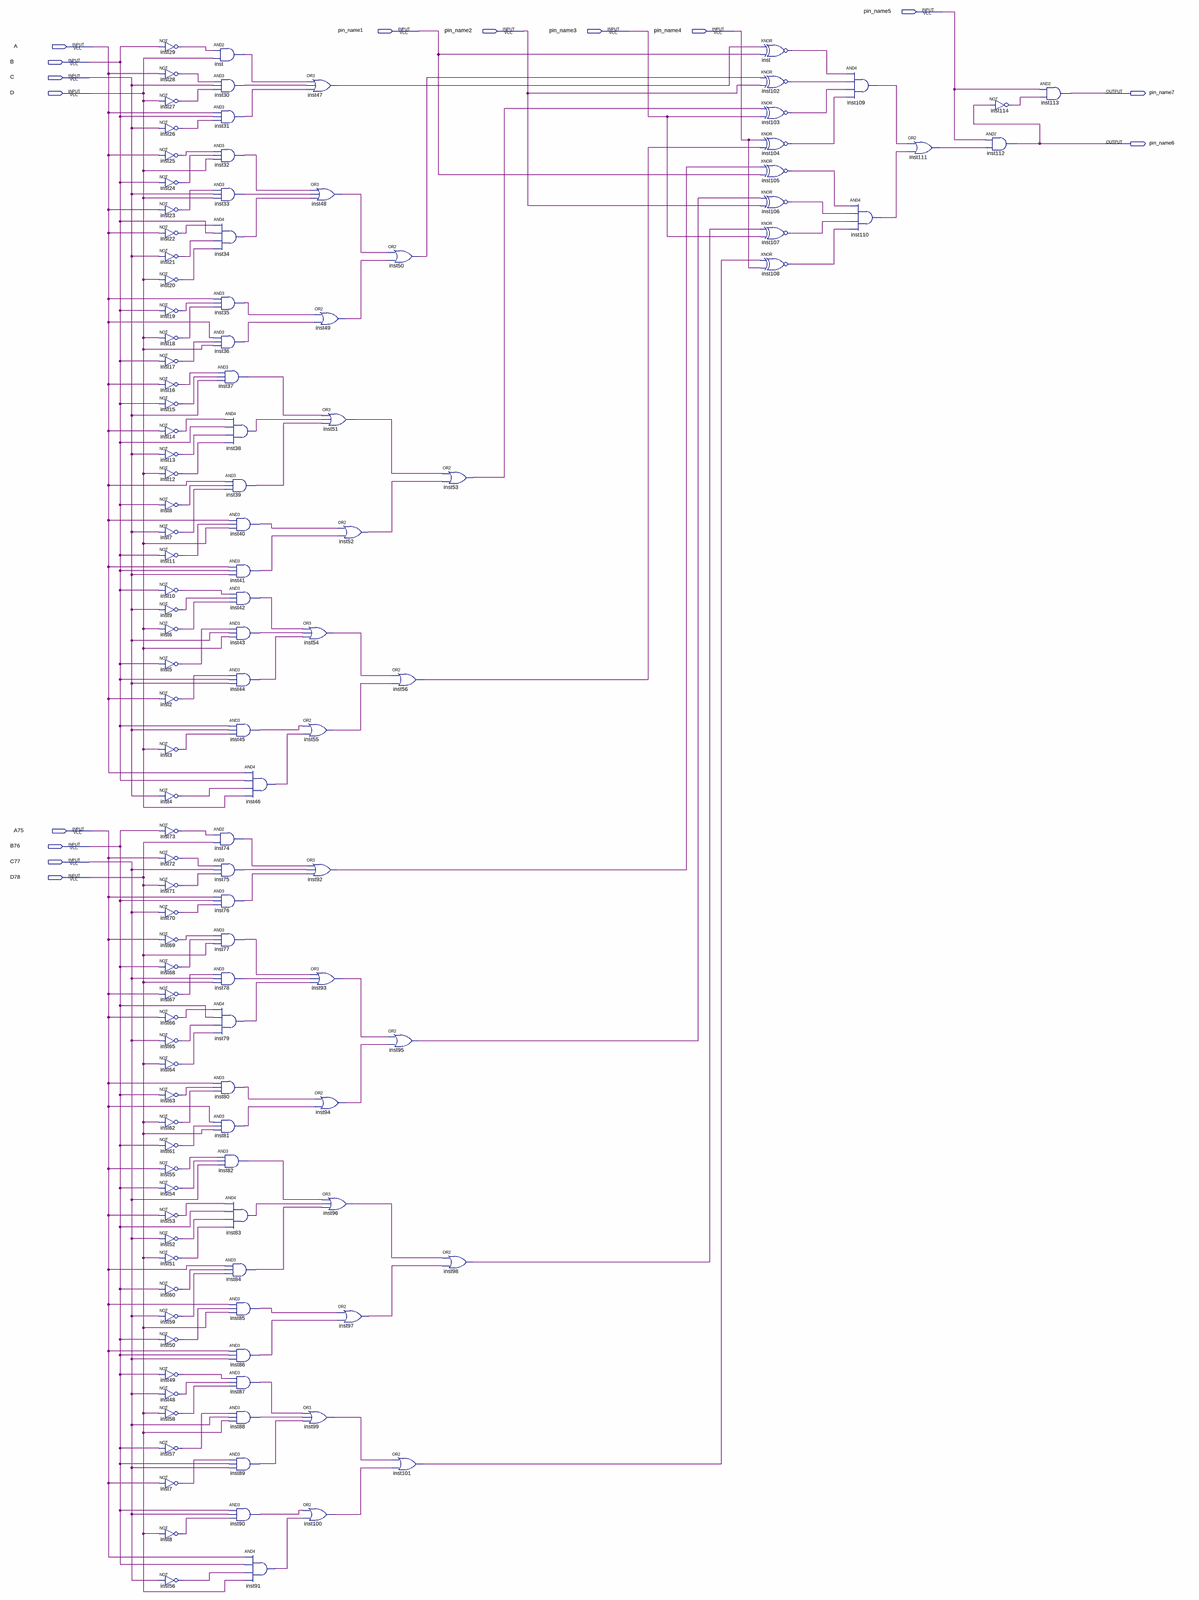
[diagram p0: schematic sheet, whole]
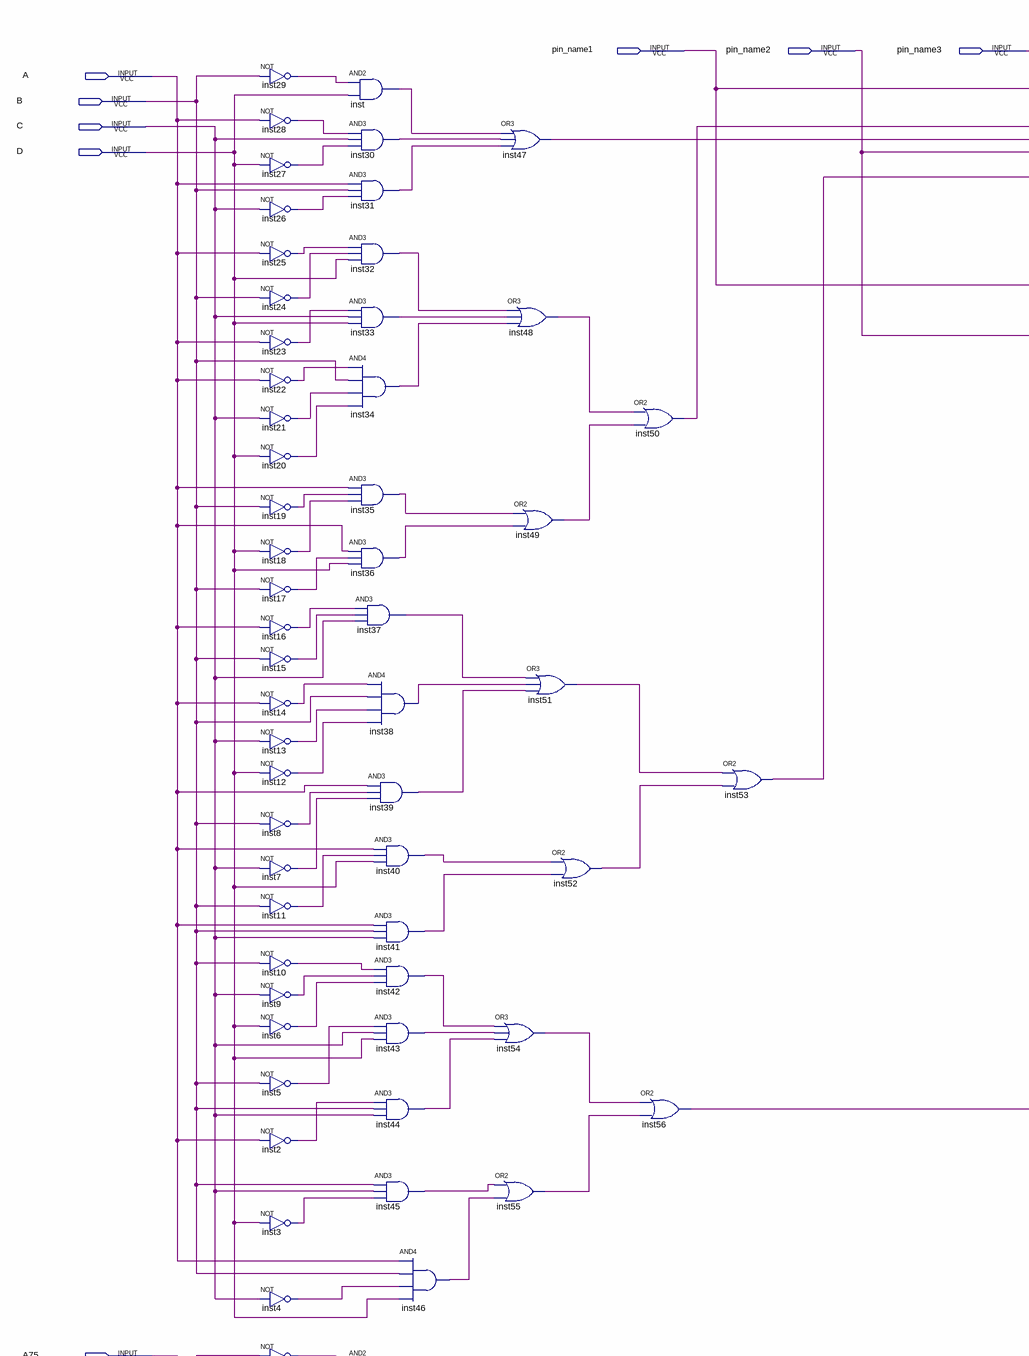
[diagram p1: schematic sheet, upper left part]
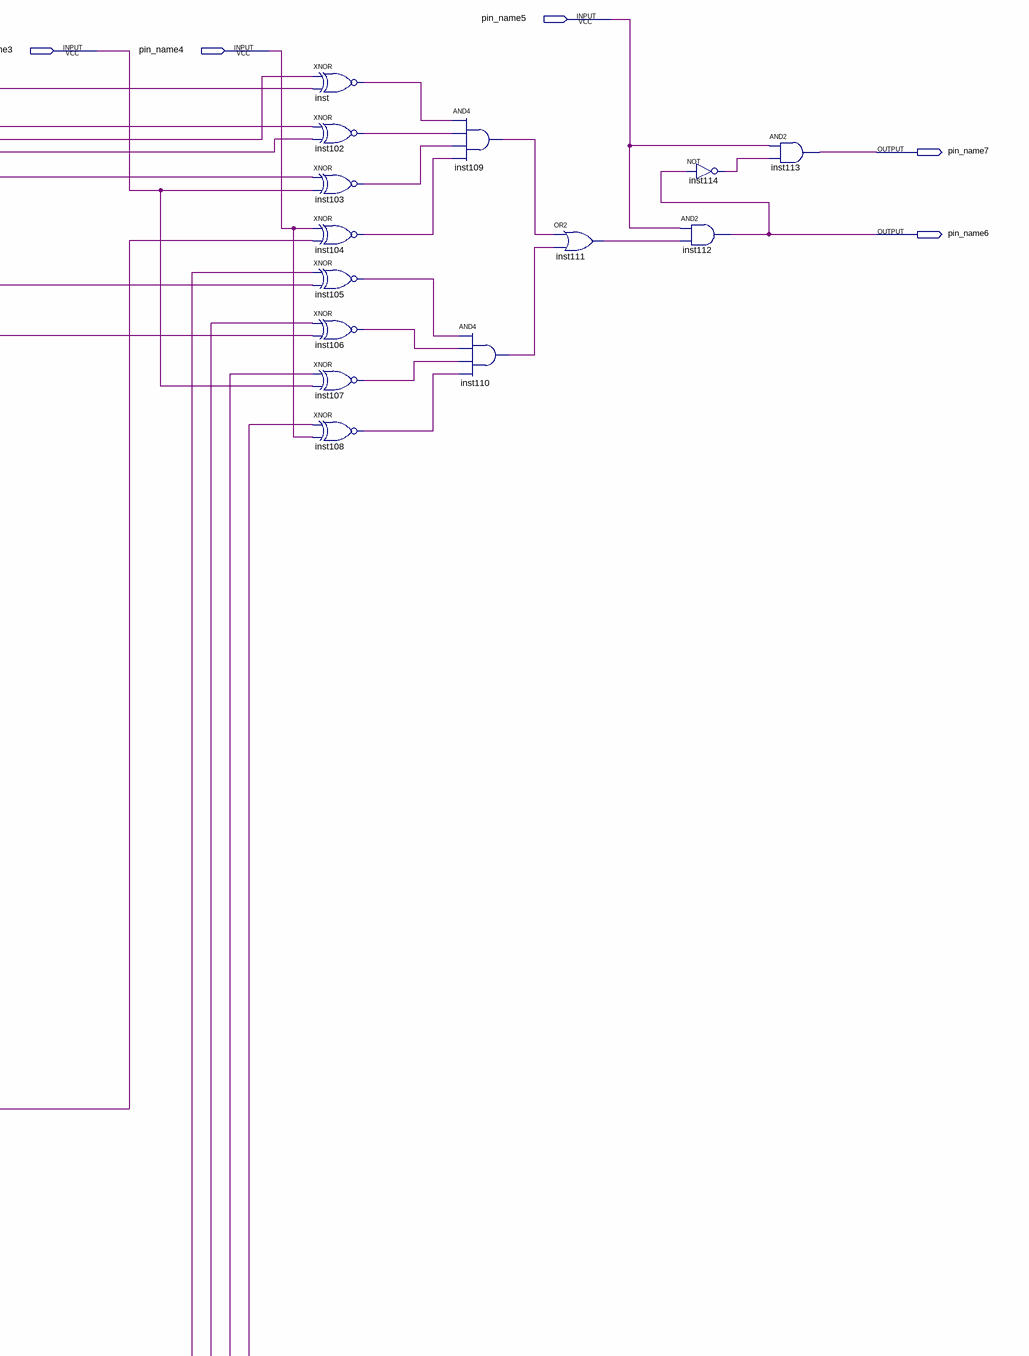
[diagram p2: schematic sheet, upper right part]
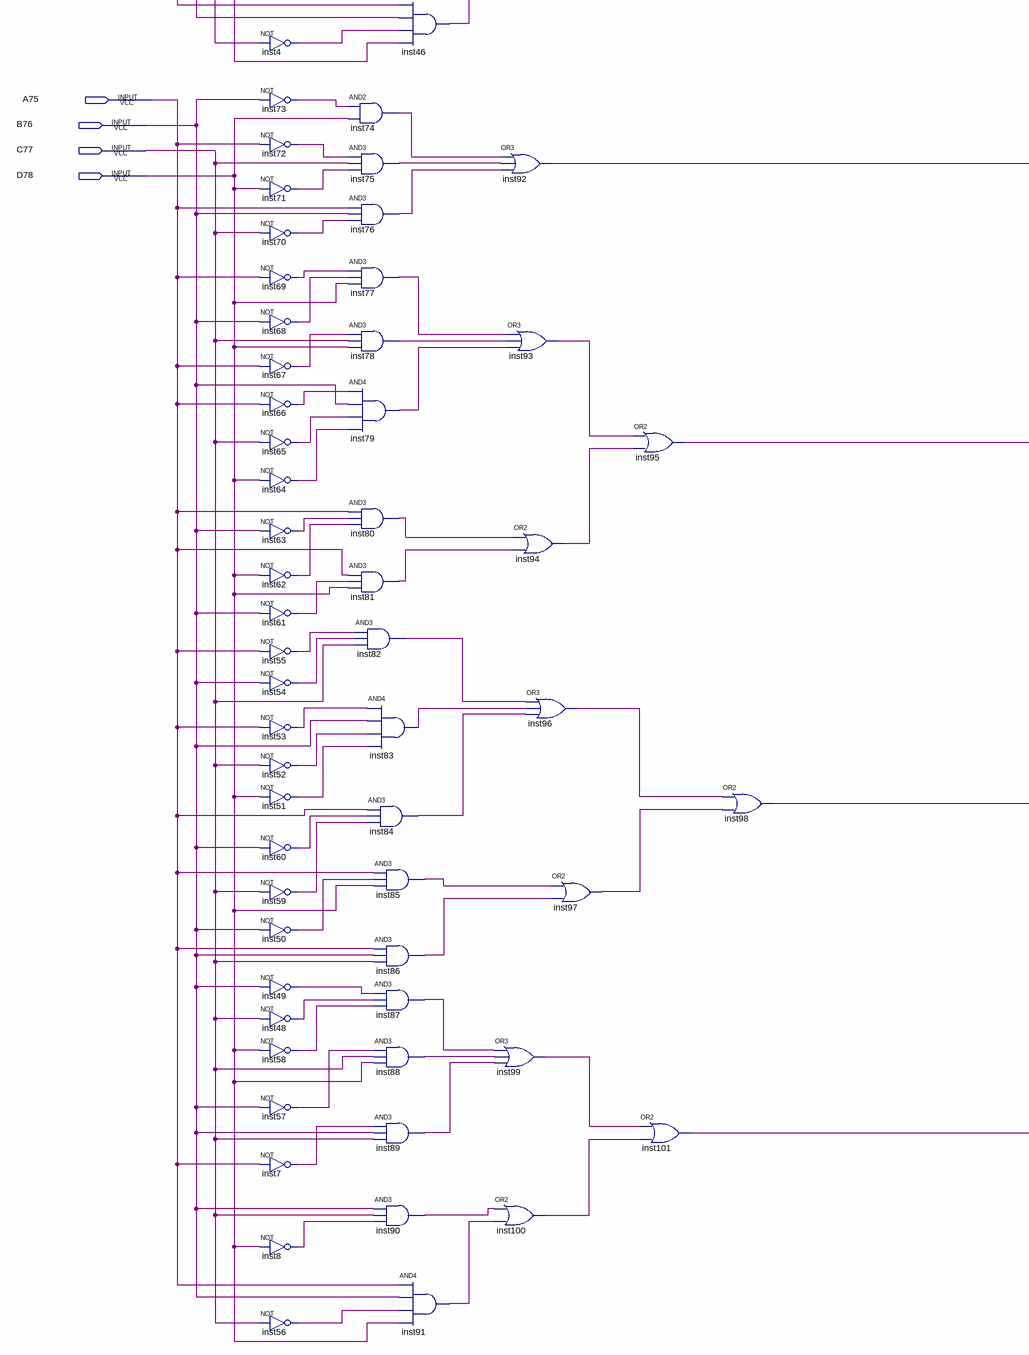
[diagram p3: schematic sheet, lower left part]
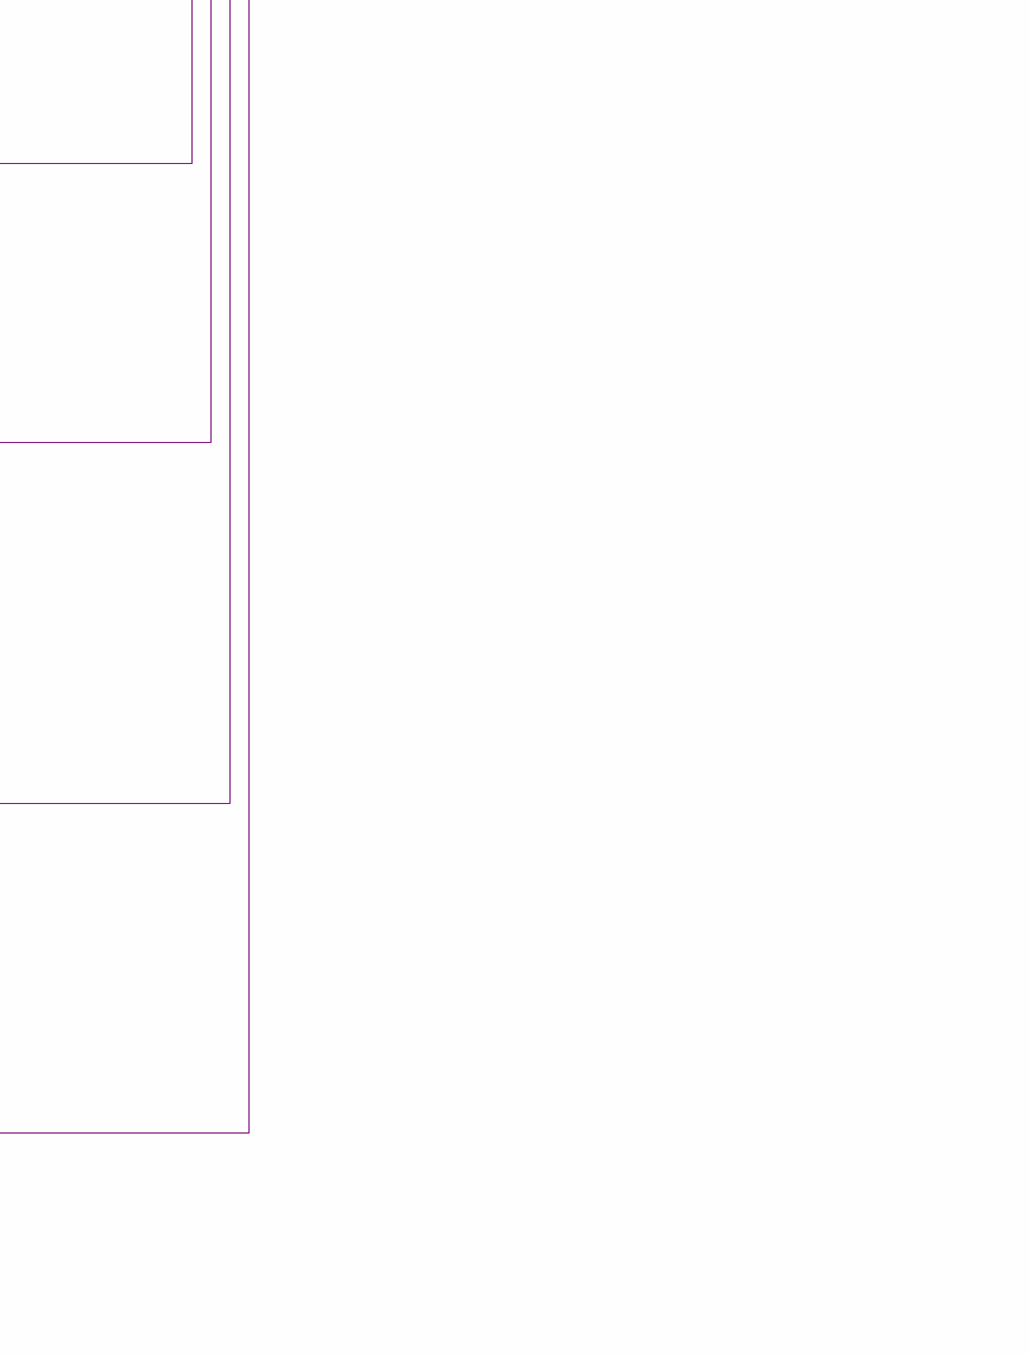
[diagram p4: schematic sheet, lower right part]
// Quartus schematic proquartus.bdf as structural Verilog: 126 symbols, 15 pins
module proquartus (
  input  pin_name5,
  input  pin_name1,
  input  pin_name2,
  input  pin_name3,
  input  pin_name4,
  input  A,
  input  B,
  input  C,
  input  D,
  input  A75,
  input  B76,
  input  C77,
  input  D78,
  output pin_name7,
  output pin_name6
);

  wire inst2_out, inst3_out, inst4_out, inst5_out, inst6_out, inst7_out, inst7_out_2, inst8_out, inst8_out_2,
       inst9_out, inst10_out, inst11_out, inst12_out, inst13_out, inst14_out, inst15_out, inst16_out,
       inst17_out, inst18_out, inst19_out, inst20_out, inst21_out, inst22_out, inst23_out, inst24_out,
       inst25_out, inst26_out, inst27_out, inst28_out, inst29_out, inst30_out, inst31_out, inst32_out,
       inst33_out, inst34_out, inst35_out, inst36_out, inst37_out, inst38_out, inst39_out, inst40_out,
       inst41_out, inst42_out, inst43_out, inst44_out, inst45_out, inst46_out, inst47_out, inst48_out,
       inst48_out_2, inst49_out, inst49_out_2, inst50_out, inst50_out_2, inst51_out, inst51_out_2,
       inst52_out, inst52_out_2, inst53_out, inst53_out_2, inst54_out, inst54_out_2, inst55_out,
       inst55_out_2, inst56_out, inst56_out_2, inst57_out, inst58_out, inst59_out, inst60_out, inst61_out,
       inst62_out, inst63_out, inst64_out, inst65_out, inst66_out, inst67_out, inst68_out, inst69_out,
       inst70_out, inst71_out, inst72_out, inst73_out, inst74_out, inst75_out, inst76_out, inst77_out,
       inst78_out, inst79_out, inst80_out, inst81_out, inst82_out, inst83_out, inst84_out, inst85_out,
       inst86_out, inst87_out, inst88_out, inst89_out, inst90_out, inst91_out, inst92_out, inst93_out,
       inst94_out, inst95_out, inst96_out, inst97_out, inst98_out, inst99_out, inst100_out, inst101_out,
       inst102_out, inst103_out, inst104_out, inst105_out, inst106_out, inst107_out, inst108_out,
       inst109_out, inst110_out, inst111_out, inst114_out, inst_out, inst_out_2;

  not inst29 (inst29_out, B);
  not inst28 (inst28_out, A);
  not inst27 (inst27_out, D);
  not inst26 (inst26_out, C);
  not inst25 (inst25_out, A);
  not inst24 (inst24_out, B);
  not inst23 (inst23_out, A);
  not inst22 (inst22_out, A);
  not inst21 (inst21_out, C);
  not inst20 (inst20_out, D);
  not inst19 (inst19_out, B);
  not inst18 (inst18_out, D);
  not inst17 (inst17_out, B);
  not inst16 (inst16_out, A);
  not inst15 (inst15_out, B);
  not inst14 (inst14_out, A);
  not inst13 (inst13_out, C);
  not inst12 (inst12_out, D);
  not inst8 (inst8_out, B);
  not inst7 (inst7_out, C);
  not inst11 (inst11_out, B);
  not inst10 (inst10_out, B);
  not inst9 (inst9_out, C);
  not inst6 (inst6_out, D);
  not inst5 (inst5_out, B);
  not inst2 (inst2_out, A);
  not inst3 (inst3_out, D);
  not inst4 (inst4_out, C);
  not inst73 (inst73_out, B76);
  not inst72 (inst72_out, A75);
  not inst71 (inst71_out, D78);
  not inst70 (inst70_out, C77);
  not inst69 (inst69_out, A75);
  not inst68 (inst68_out, B76);
  not inst67 (inst67_out, A75);
  not inst66 (inst66_out, A75);
  not inst65 (inst65_out, C77);
  not inst64 (inst64_out, D78);
  not inst63 (inst63_out, B76);
  not inst62 (inst62_out, D78);
  not inst61 (inst61_out, B76);
  not inst55 (inst55_out_2, A75);
  not inst54 (inst54_out_2, B76);
  not inst53 (inst53_out, A75);
  not inst52 (inst52_out_2, C77);
  not inst51 (inst51_out_2, D78);
  not inst60 (inst60_out, B76);
  not inst59 (inst59_out, C77);
  not inst50 (inst50_out, B76);
  not inst49 (inst49_out_2, B76);
  not inst48 (inst48_out_2, C77);
  not inst58 (inst58_out, D78);
  not inst57 (inst57_out, B76);
  not inst7_dup2 (inst7_out_2, A75);
  not inst8_dup2 (inst8_out_2, D78);
  not inst56 (inst56_out, C77);
  and inst (inst_out, inst29_out, D);
  and inst30 (inst30_out, inst28_out, C, inst27_out);
  and inst31 (inst31_out, A, B, inst26_out);
  and inst32 (inst32_out, inst25_out, inst24_out, D);
  and inst33 (inst33_out, inst23_out, C, D);
  and inst34 (inst34_out, inst22_out, B, inst21_out, inst20_out);
  and inst35 (inst35_out, A, inst19_out, inst18_out);
  and inst36 (inst36_out, A, inst17_out, D);
  and inst74 (inst74_out, inst73_out, D78);
  and inst75 (inst75_out, inst72_out, C77, inst71_out);
  and inst76 (inst76_out, A75, B76, inst70_out);
  and inst77 (inst77_out, inst69_out, inst68_out, D78);
  and inst78 (inst78_out, inst67_out, C77, D78);
  and inst79 (inst79_out, inst66_out, B76, inst65_out, inst64_out);
  and inst80 (inst80_out, A75, inst63_out, inst62_out);
  and inst81 (inst81_out, A75, inst61_out, D78);
  and inst37 (inst37_out, inst16_out, inst15_out, C);
  and inst38 (inst38_out, inst14_out, B, inst13_out, inst12_out);
  and inst39 (inst39_out, A, inst8_out, inst7_out);
  and inst40 (inst40_out, A, inst11_out, D);
  and inst41 (inst41_out, A, B, C);
  and inst42 (inst42_out, inst10_out, inst9_out, inst6_out);
  and inst43 (inst43_out, inst5_out, C, D);
  and inst44 (inst44_out, inst2_out, B, C);
  and inst45 (inst45_out, B, C, inst3_out);
  and inst46 (inst46_out, A, B, inst4_out, D);
  and inst82 (inst82_out, inst55_out_2, inst54_out_2, C77);
  and inst83 (inst83_out, inst53_out, B76, inst52_out_2, inst51_out_2);
  and inst84 (inst84_out, A75, inst60_out, inst59_out);
  and inst85 (inst85_out, A75, inst50_out, D78);
  and inst86 (inst86_out, A75, B76, C77);
  and inst87 (inst87_out, inst49_out_2, inst48_out_2, inst58_out);
  and inst88 (inst88_out, inst57_out, C77, D78);
  and inst89 (inst89_out, inst7_out_2, B76, C77);
  and inst90 (inst90_out, B76, C77, inst8_out_2);
  and inst91 (inst91_out, A75, B76, inst56_out, D78);
  or inst47 (inst47_out, inst_out, inst30_out, inst31_out);
  or inst54_dup2 (inst54_out, inst42_out, inst43_out, inst44_out);
  or inst55_dup2 (inst55_out, inst45_out, inst46_out);
  or inst92 (inst92_out, inst74_out, inst75_out, inst76_out);
  or inst99 (inst99_out, inst87_out, inst88_out, inst89_out);
  or inst100 (inst100_out, inst90_out, inst91_out);
  or inst48_dup2 (inst48_out, inst32_out, inst33_out, inst34_out);
  or inst49_dup2 (inst49_out, inst35_out, inst36_out);
  or inst51_dup2 (inst51_out, inst37_out, inst38_out, inst39_out);
  or inst52_dup2 (inst52_out, inst40_out, inst41_out);
  or inst93 (inst93_out, inst77_out, inst78_out, inst79_out);
  or inst94 (inst94_out, inst80_out, inst81_out);
  or inst96 (inst96_out, inst82_out, inst83_out, inst84_out);
  or inst97 (inst97_out, inst85_out, inst86_out);
  or inst50_dup2 (inst50_out_2, inst48_out, inst49_out);
  or inst56_dup2 (inst56_out_2, inst54_out, inst55_out);
  or inst95 (inst95_out, inst93_out, inst94_out);
  or inst101 (inst101_out, inst99_out, inst100_out);
  or inst53_dup2 (inst53_out_2, inst51_out, inst52_out);
  or inst98 (inst98_out, inst96_out, inst97_out);
  xnor inst_dup2 (inst_out_2, inst47_out, pin_name1);
  xnor inst102 (inst102_out, inst50_out_2, pin_name2);
  xnor inst103 (inst103_out, inst53_out_2, pin_name3);
  xnor inst104 (inst104_out, pin_name4, inst56_out_2);
  xnor inst105 (inst105_out, inst92_out, pin_name1);
  xnor inst106 (inst106_out, inst95_out, pin_name2);
  xnor inst107 (inst107_out, inst98_out, pin_name3);
  xnor inst108 (inst108_out, inst101_out, pin_name4);
  and inst109 (inst109_out, inst_out_2, inst102_out, inst103_out, inst104_out);
  and inst110 (inst110_out, inst105_out, inst106_out, inst107_out, inst108_out);
  or inst111 (inst111_out, inst109_out, inst110_out);
  not inst114 (inst114_out, pin_name6);
  and inst112 (pin_name6, pin_name5, inst111_out);
  and inst113 (pin_name7, pin_name5, inst114_out);
endmodule
